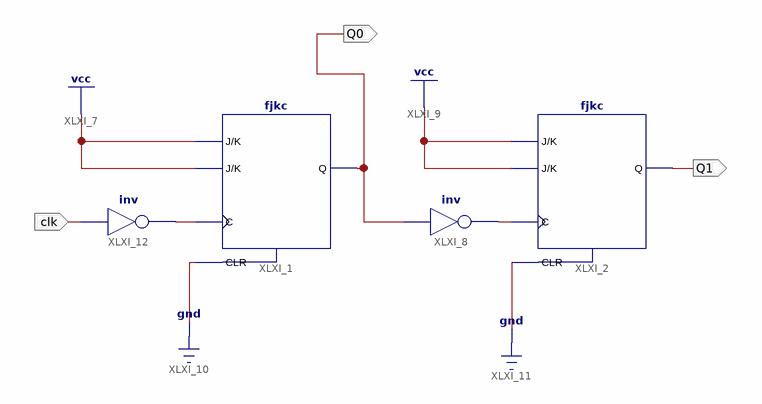
[diagram p0: schematic sheet 1]
// Xilinx ISE schematic FlipFlop.sch (spartan3) as structural Verilog: 4 symbols, 3 ports
module FlipFlop (
  input  clk,
  output Q1,
  output Q0
);

  wire XLXN_28, XLXN_40;

  fjkc XLXI_1 (.C(XLXN_40), .CLR(1'b0), .J(1'b1), .K(1'b1), .Q(Q0));
  fjkc XLXI_2 (.C(XLXN_28), .CLR(1'b0), .J(1'b1), .K(1'b1), .Q(Q1));
  not XLXI_8 (XLXN_28, Q0);
  not XLXI_12 (XLXN_40, clk);
endmodule
